# EAGLE schematic schematic showing Arduino connection (EAGLE 6.5.0)
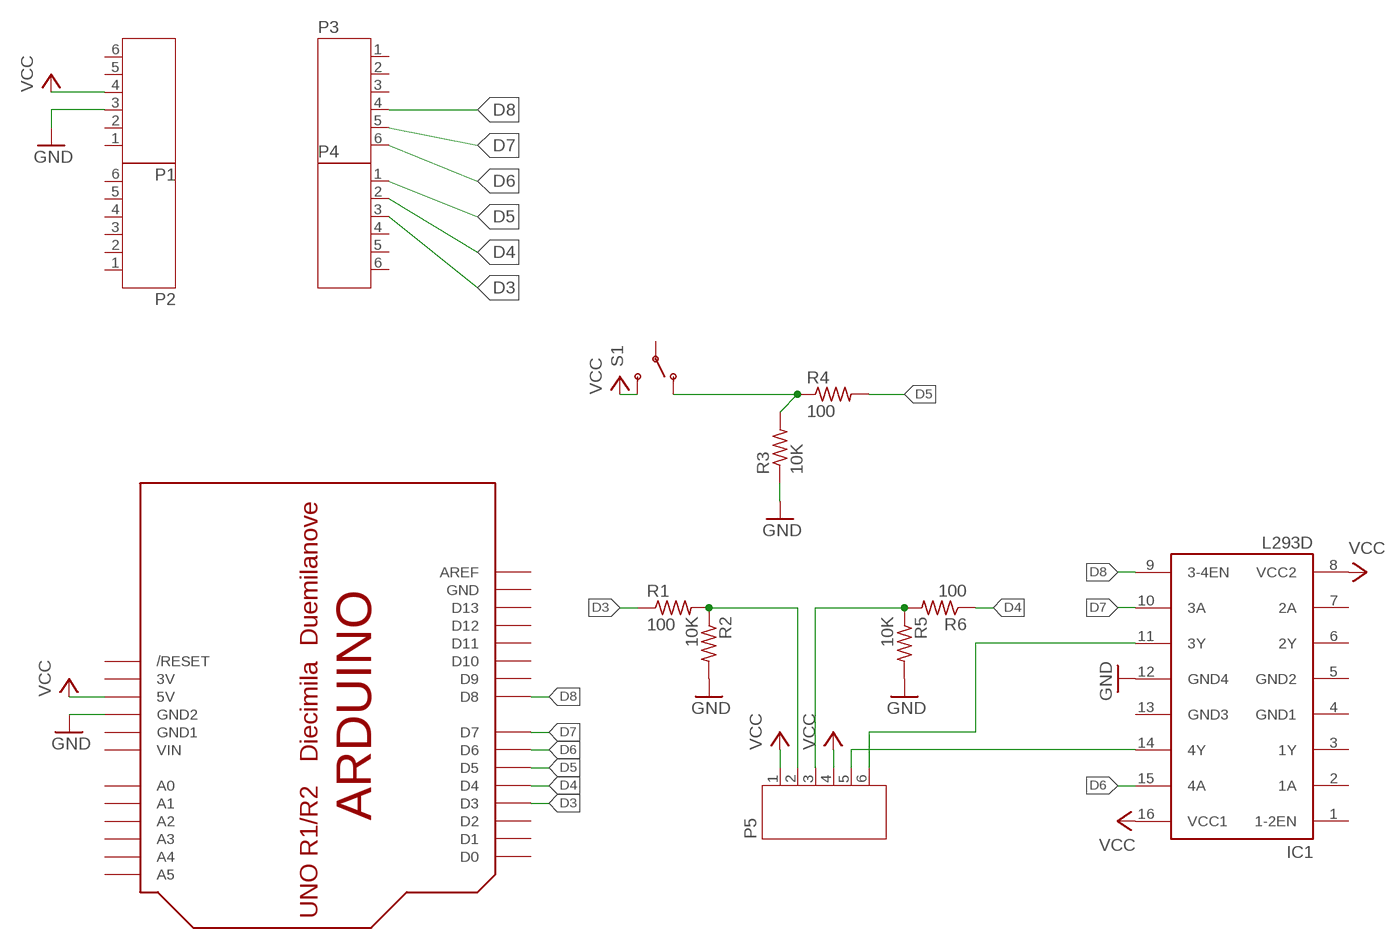
[diagram p0: schematic, sheet 1]

## Parts
IC1  L293D  [DIL16]
P1  JST-PH6  [JST-PH6]
P2  JST-PH6  [JST-PH6]
P3  JST-PH6  [JST-PH6]
P4  JST-PH6  [JST-PH6]
P5  JST-PH6  [JST-PH6]
R1  100  FLIPFLOP-RES  [0805-THM]
R2  10K  FLIPFLOP-RES  [0805-THM]
R3  10K  FLIPFLOP-RES  [0805-THM]
R4  100  FLIPFLOP-RES  [0805-THM]
R5  10K  FLIPFLOP-RES  [0805-THM]
R6  100  FLIPFLOP-RES  [0805-THM]
S1  SWITCH-SPSTPTH  [SWITCH-SPDT]
U$1  ARDUINO-BPLACE  [ARDUINO-BPLACE]

## Nets
D3: P4.3 R1.1 U$1.D3
D4: P4.2 R6.1 U$1.D4
D5: P4.1 R4.2 U$1.D5
D6: IC1.15(4A) P3.6 U$1.D6
D7: IC1.10(3A) P3.5 U$1.D7
D8: IC1.9(3-4EN) P3.4 U$1.D8
GND: IC1.12(GND4) P1.3 R2.2 R3.1 R5.2 U$1.GND2
N$1: R3.2 R4.1 S1.1(O)
N$2: P5.3 R5.1 R6.2
N$3: P5.2 R1.2 R2.1
N$4: IC1.11(3Y) P5.6
N$5: IC1.14(4Y) P5.5
VCC: IC1.8(VCC2) IC1.16(VCC1) P1.4 P5.1 P5.4 S1.3(S) U$1.5V
Unconnected: IC1.1(1-2EN) IC1.2(1A) IC1.3(1Y) IC1.6(2Y) IC1.7(2A) P1.1 P1.2 P1.5 P1.6 P2.1 P2.2 P2.3 P2.4 P2.5 P2.6 P3.1 P3.2 P3.3 P4.4 P4.5 P4.6 S1.2(P) U$1.A0 U$1.A1 U$1.A2 U$1.A3 U$1.A4 U$1.A5 U$1.AREF U$1.D0 U$1.D1 U$1.D2 U$1.D9 U$1.D10 U$1.D11 U$1.D12 U$1.D13 U$1.RESET(/RESET)

## Power pins joined to a net without a drawn wire
3V: U$1.3V
GND: U$1.GND
GND1: IC1.4(GND1) U$1.GND1
GND2: IC1.5(GND2)
GND3: IC1.13(GND3)
VIN: U$1.VIN

## Library data of the parts
IC1 = st-microelectronics:L293D: PUSH-PULL 4 CHANNEL DRIVER; MF: TEXAS INSTRUMENTS; MPN: L293DNEE4; OC_FARNELL: 9589619; OC_NEWARK: 56P8249
P1-P4 = jst-ph:JST-PH6
P5 = jst-ph:JST-PH6; OC_FARNELL: unknown
R1 R4 R6 = adafruit:FLIPFLOP-RES: Flip Flop resistor An 0805 resistor inside a standard 1/4W 5% resistor. Makes for easy mods; MF: STANLEY FAT MAX; MPN: 0-65-425; OC_FARNELL: 1520953
R2 R3 R5 = adafruit:FLIPFLOP-RES: Flip Flop resistor An 0805 resistor inside a standard 1/4W 5% resistor. Makes for easy mods; OC_FARNELL: unknown
S1 = SparkFun:SWITCH-SPST: SPST Switch Simple slide switch. Spark Fun Electronics SKU : COM-00102; OC_FARNELL: unknown
U$1 = adafruit:ARDUINO: Arduino Diecimila/Duemilanove Make a shield with ease, this package has all the named pins as well as the two mounting drill holes and an outline of the USB and DC power connector. The outline is on the DIMENSION layer, so if your board house uses it they will cut the outline to match. http://www.ladyada.net/library/pcb/eaglelibrary.html; OC_FARNELL: unknown

## Net classes
0 GND: width 0.508 mm, drill 0.381 mm, clearance 0.305 mm